# Altium schematic sheet LOGIC AND POWER.SchDoc
size A4; SheetNumber: 3; SheetTotal: 3
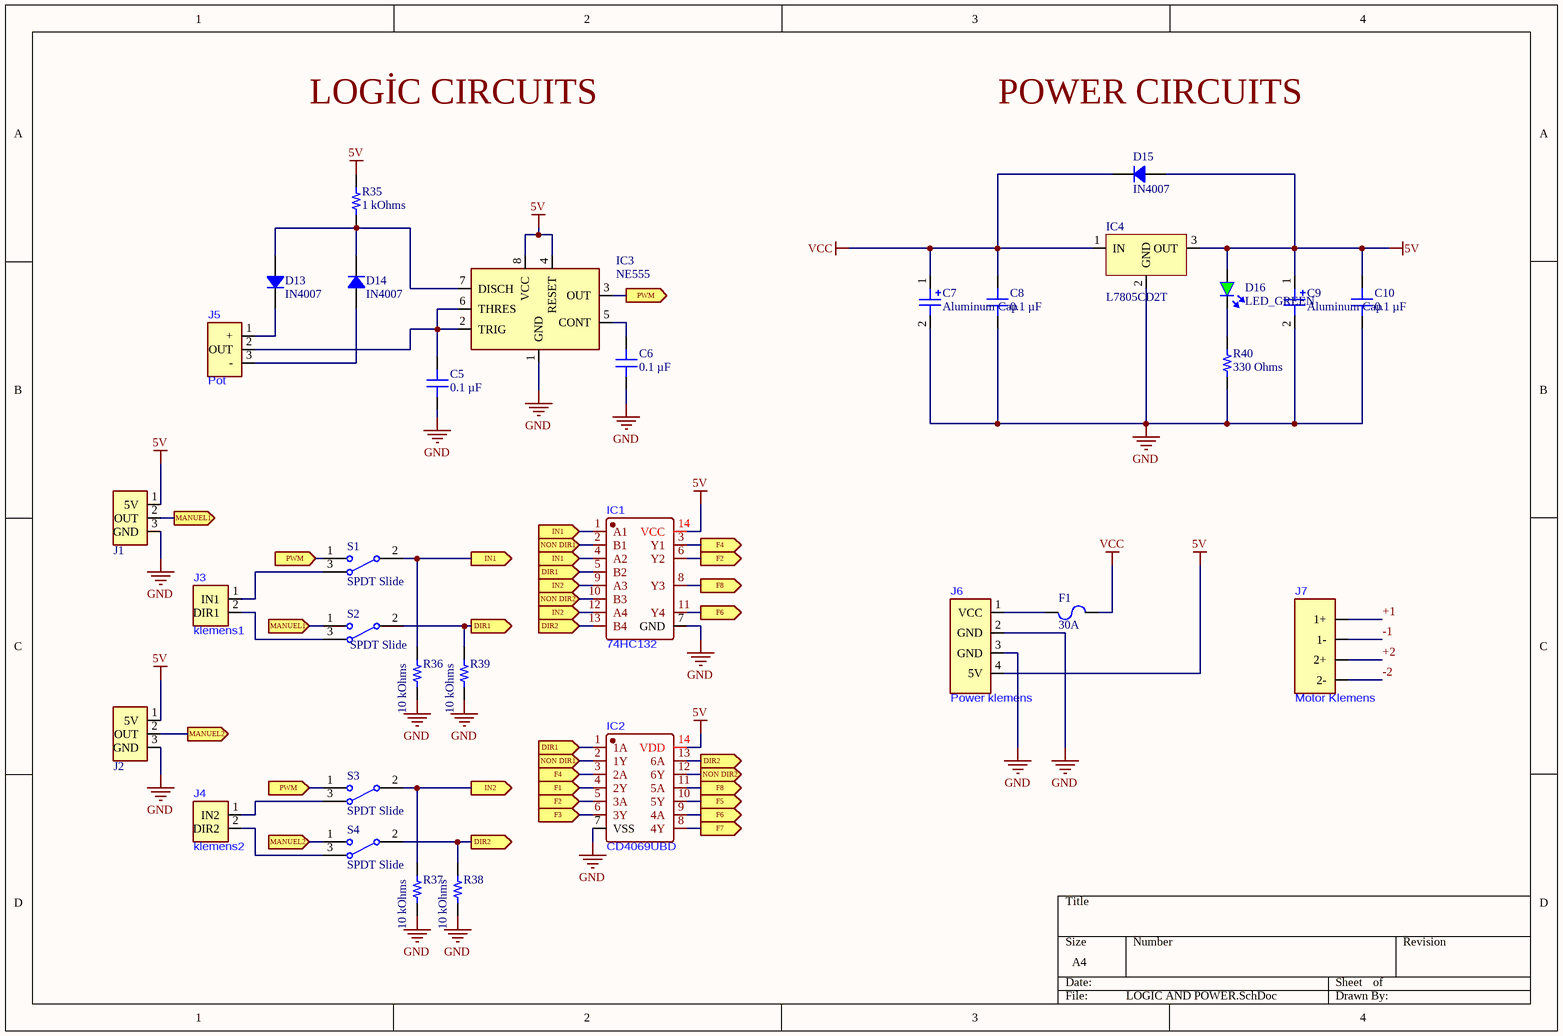
[diagram p0: LOGIC AND POWER.SchDoc]

## Parts
C5  0.1 µF  [CAP 1210_3225 - 1MM]
C6  0.1 µF  [CAP 1210_3225 - 1MM]
C7  Aluminum Cap  [Aluminum Cap]
C8  0.1 µF  [CAP 1210_3225 - 1MM]
C9  Aluminum Cap  [Aluminum Cap]
C10  0.1 µF  [CAP 1210_3225 - 1MM]
D13  IN4007  [DO214AC SMA]
D14  IN4007  [DO214AC SMA]
D15  IN4007  [DO214AC SMA]
D16  LED_GREEN  [LED_GREEN]
F1  30A  [FUSE 1206_3216 0.6MM]
IC1  74HC132  [SOIC14]
IC2  CD4069UBD  [SOIC14]
IC3  NE555  [NE5532-SOIC8]
IC4  L7805CD2T  [L7805CD2T]
J1  Switch  [JST-XH 2.54 - duplicate]  (value not drawn)
J2  Switch  [JST-XH 2.54 - duplicate]  (value not drawn)
J3  klemens1  [Klemens]
J4  klemens2  [Klemens]
J5  Pot  [JST-XH 2.54]
J6  Power klemens  [Power Klemens]
J7  Motor Klemens  [Power Klemens]
R35  1 kOhms  [RES 1206_3216]
R36  10 kOhms  [RES 1210_3225]
R37  10 kOhms  [RES 1210_3225]
R38  10 kOhms  [RES 1210_3225]
R39  10 kOhms  [RES 1210_3225]
R40  330 Ohms  [RES 1210_3225]
S1  SPDT Slide  [SPDT]
S2  SPDT Slide  [SPDT]
S3  SPDT Slide  [SPDT]
S4  SPDT Slide  [SPDT]

## Ports
DIR1 (in, see LOGIC AND POWER[2C]), DIR1 (out, see LOGIC AND POWER[2C]), DIR2 (in, see LOGIC AND POWER[2C], LOGIC AND POWER[2D]), DIR2 (out, see LOGIC AND POWER[2C]), DIR2 (out, see LOGIC AND POWER[2C], LOGIC AND POWER[2D]), F1 (in, see RIGHT_MOTOR[1B]), F2 (in, see LOGIC AND POWER[2C], RIGHT_MOTOR[1C]), F2 (out, see LOGIC AND POWER[2D], RIGHT_MOTOR[1C]), F3 (in, see RIGHT_MOTOR[4B]), F4 (in, see LOGIC AND POWER[2C], RIGHT_MOTOR[4C]), F4 (out, see LOGIC AND POWER[2D], RIGHT_MOTOR[4C]), F5 (out, see LEFT_MOTOR[1B]), F6 (out, see LEFT_MOTOR[1C], LOGIC AND POWER[2C]), F6 (out, see LEFT_MOTOR[1C], LOGIC AND POWER[2D]), F7 (out, see LEFT_MOTOR[4B]), F8 (out, see LEFT_MOTOR[4C], LOGIC AND POWER[2C]), F8 (out, see LEFT_MOTOR[4C], LOGIC AND POWER[2D]), IN1 (in, see LOGIC AND POWER[2C]), IN1 (out, see LOGIC AND POWER[2C]), IN2 (in, see LOGIC AND POWER[2C], LOGIC AND POWER[2D]), IN2 (out, see LOGIC AND POWER[2C]), MANUEL1 (in, see LOGIC AND POWER[1C]), MANUEL1 (out, see LOGIC AND POWER[1C]), MANUEL2 (in, see LOGIC AND POWER[1C]), MANUEL2 (out, see LOGIC AND POWER[1D]), NON DIR1 (in, see LOGIC AND POWER[2C]), NON DIR2 (in, see LOGIC AND POWER[2D]), NON DIR2 (out, see LOGIC AND POWER[2C]), PWM (in, see LOGIC AND POWER[1C], LOGIC AND POWER[2B]), PWM (in, see LOGIC AND POWER[1D], LOGIC AND POWER[2B]), PWM (out, see LOGIC AND POWER[1C], LOGIC AND POWER[1D])

## Nets
5V: C9.1(in) C10.2 D15.1 D16.1(IN) IC1.14(VCC) IC2.14(VDD) IC3.4(RESET) IC3.8(VCC) IC4.3(OUT) J1.1(5V) J2.1(5V) J6.4(5V) R35.1
GND: C5.1 C6.1 C7.2(out) C8.1 C9.2(out) C10.1 IC1.7(GND) IC2.7(VSS) IC3.1(GND) IC4.2(GND) J1.3(GND) J2.3(GND) J6.2(GND) J6.3(GND) R36.1 R37.1 R38.1 R39.1 R40.1
VCC: C7.1(in) C8.2 D15.2 F1.2 IC4.1(IN)
+1: J7.1(1+)
+2: J7.3(2+)
-1: J7.2(1-)
-2: J7.4(2-)
DIR1: IC1.5(B2) IC2.1(1A) R39.2 S2.2 ; port DIR1
DIR2: IC1.13(B4) IC2.13(6A) R38.2 S4.2 ; port DIR2
F1: IC2.4(2Y) ; port F1
F2: IC1.6(Y2) IC2.5(3A) ; port F2
F3: IC2.6(3Y) ; port F3
F4: IC1.3(Y1) IC2.3(2A) ; port F4
F5: IC2.10(5Y) ; port F5
F6: IC1.11(Y4) IC2.9(4A) ; port F6
F7: IC2.8(4Y) ; port F7
F8: IC1.8(Y3) IC2.11(5A) ; port F8
IN1: IC1.1(A1) IC1.4(A2) R36.2 S1.2 ; port IN1
IN2: IC1.9(A3) IC1.12(A4) R37.2 S3.2 ; port IN2
MANUEL1: J1.2(OUT) S2.1(MANUEL) ; port MANUEL1
MANUEL2: J2.2(OUT) S4.1(MANUEL) ; port MANUEL2
NON DIR1: IC1.2(B1) IC2.2(1Y) ; port NON DIR1
NON DIR2: IC1.10(B3) IC2.12(6Y) ; port NON DIR2
PWM: IC3.3(OUT) S1.1(PWM) S3.1(PWM) ; port PWM
NetC5_2: C5.2 IC3.2(TRIG) IC3.6(THRES) J5.2(OUT)
NetC6_2: C6.2 IC3.5(CONT)
NetD13_1: D13.1 D14.2 IC3.7(DISCH) R35.2
NetD13_2: D13.2 J5.1(+)
NetD14_1: D14.1 J5.3(-)
NetD16_2: D16.2(OUT) R40.2
NetF1_1: F1.1 J6.1(VCC)
NetJ3_1: J3.1(IN1) S1.3(MCU)
NetJ3_2: J3.2(DIR1) S2.3(MCU)
NetJ4_1: J4.1(IN2) S3.3(MCU)
NetJ4_2: J4.2(DIR2) S4.3(MCU)

## Notes on the sheet
- Labels drawn without touching a wire or pin: LOGİC CIRCUITS, POWER CIRCUITS

## Library data of the parts
C5 C6 C8 C10 = 1210Y0500104KST: 1210 50VDC 100NF 10% X7R(2R1) AE; manufacturer: Knowles Syfer; Voltage - Rated: 50V; Part Number: 1210Y0500104KST; Value: 0.1 µF; Applications: Automotive, Boardflex Sensitive; Capacitance: 0.1 µF; componentlink2description: DigiKey Link; componentlink2url: https://www.digikey.com/en/products/detail/knowles-syfer/1210Y0500104KST/18879780; Device Package: 1210 (3225 Metric); Features: Soft Termination; Lifecycle Status: Active; Minimum Order: 1; Mounting Type: Surface Mount, MLCC; Operating Temperature: -55°C ~ 125°C; Package / Case: 1210 (3225 Metric); packaging: TapeAndReel; partid: 53037; Part Status: Active; price: 0.16; Ratings: AEC-Q200; series: FlexiCap™; Size / Dimension: 0.126" L x 0.098" W (3.20mm x 2.50mm); Supplier 1: DigiKey; Supplier Part Number 1: 1608-1210Y0500104KSTCT-ND; Temperature Coefficient: X7R (2R1); Thickness (Max): 0.079" (2.00mm); Tolerance: ±10%
  C5 C6: lastupdated: 18.12.2023 20:42:16
  C8 C10: lastupdated: 5.12.2023 20:39:07
D13-D15 = RS1A: DIODE GEN PURP 50V 1A SMA; Part Number: RS1A; Manufacturer: ON Semiconductor; Capacitance @ Vr, F: 10pF @ 4V, 1MHz; Current - Reverse Leakage @ Vr: 5µA @ 50V; Diode Type: Standard; Reverse Recovery Time (trr): 150ns; Speed: Fast Recovery =< 500ns, > 200mA (Io); Voltage - Forward (Vf) (Max) @ If: 1.3V @ 1A; ComponentLink1Description: Datasheet; ComponentLink1URL: https://www.onsemi.com/pub/Collateral/RS1M-D.PDF; ComponentLink2Description: DigiKey Link; ComponentLink2URL: http://digikey.com/product-detail/en/on-semiconductor/RS1A/RS1ACT-ND/3504478; Current - Average Rectified (Io): 1A; LastUpdated: 4.12.2023 21:20:44; Lifecycle Status: Active; Minimum Order: 1; Mounting Type: Surface Mount; Operating Temperature - Junction: -55°C ~ 150°C; Package / Case: DO-214AC, SMA; Packaging: TapeAndReel; PartId: 585; Part Status: Active; Price: 0.08; Series: -; Supplier 1: DigiKey; Supplier Part Number 1: RS1ACT-ND; Supplier Device Package: SMA (DO-214AC); Voltage - DC Reverse (Vr) (Max): 50V
F1 = 3413.0120.22: FUSE BOARD MNT 2.5A 32VAC 63VDC; Manufacturer: Schurter Inc.; Approval Agency: cURus; Breaking Capacity @ Rated Voltage: 50A; Fuse Type: Board Mount (Cartridge Style Excluded); Melting I²t: 0.35; Response Time: Fast Blow; Voltage Rating - AC: 32V; Voltage Rating - DC: 63V; Part Number: 3413.0120.22; Approvals: cURus; ComponentLink1Description: Datasheet; ComponentLink1URL: http://www.schurterinc.com/bundles/snceschurter/epim/_ProdPool_/newDS/en/typ_USF_1206.pdf; ComponentLink2Description: DigiKey Link; ComponentLink2URL: http://digikey.com/product-detail/en/schurter-inc/3413.0120.22/486-1681-1-ND/2870086; Current Rating (Amps): 2.5A; Device Package: 1206 (3216 Metric); LastUpdated: 2.09.2020 01:30:41; Lifecycle Status: Active; Minimum Order: 1; Mounting Type: Surface Mount; Operating Temperature: -55°C ~ 90°C; Package / Case: 1206 (3216 Metric); Packaging: TapeAndReel; Part Status: Active; Price: 0.24; Series: USF 1206; Size / Dimension: 0.126" L x 0.063" W x 0.024" H (3.20mm x 1.60mm x 0.60mm); Supplier 1: DigiKey; Supplier Part Number 1: 486-1681-1-ND
R35 = RNCS1206BKE1K00: RES 1K OHM 0.1% 1/8W 1206; Manufacturer: Stackpole Electronics Inc; Power (Watts): 0.125W, 1/8W; Temperature Coefficient: ±25ppm/°C; Part Number: RNCS1206BKE1K00; ComponentLink1Description: Datasheet; ComponentLink1URL: https://www.seielect.com/catalog/sei-rncs_rnch.pdf; ComponentLink2Description: DigiKey Link; ComponentLink2URL: https://www.digikey.com/en/products/detail/stackpole-electronics-inc/RNCS1206BKE1K00/1800333; Composition: Thin Film; Device Package: 1206 (3216 Metric); Features: Anti-Corrosive, Automotive AEC-Q200, Moisture Resistant; Height - Seated (Max): 0.026" (0.65mm); LastUpdated: 8.12.2023 20:55:21; Lifecycle Status: Active; Minimum Order: 1; Number of Terminations: 2; Operating Temperature: -55°C ~ 155°C; Package / Case: 1206 (3216 Metric); Packaging: TapeAndReel; PartId: 26856; Part Status: Active; Price: 0.08; Ratings: AEC-Q200; Resistance: 1 kOhms; Series: RNCS; Size / Dimension: 0.120" L x 0.061" W (3.05mm x 1.55mm); Supplier 1: DigiKey; Supplier Part Number 1: RNCS1206BKE1K00CT-ND; Supplier Device Package: 1206; Tolerance: ±0.1%; Value: 1 kOhms
R36-R39 = RMCF1210FT10K0: RES 10K OHM 1% 1/2W 1210; Manufacturer: Stackpole Electronics Inc; Power (Watts): 0.5W, 1/2W; Temperature Coefficient: ±100ppm/°C; Part Number: RMCF1210FT10K0; ComponentLink1Description: Datasheet; ComponentLink1URL: https://www.seielect.com/catalog/sei-rmcf_rmcp.pdf; ComponentLink2Description: DigiKey Link; ComponentLink2URL: https://www.digikey.com/en/products/detail/stackpole-electronics-inc/RMCF1210FT10K0/1758528; Composition: Thick Film; Device Package: 1210 (3225 Metric); Features: Automotive AEC-Q200; Height - Seated (Max): 0.028" (0.70mm); LastUpdated: 17.12.2023 21:51:18; Lifecycle Status: Active; Minimum Order: 1; Number of Terminations: 2; Operating Temperature: -55°C ~ 155°C; Package / Case: 1210 (3225 Metric); Packaging: TapeAndReel; Part Status: Active; Price: 0.01; Ratings: AEC-Q200; Resistance: 10 kOhms; Series: RMCF; Size / Dimension: 0.126" L x 0.098" W (3.20mm x 2.50mm); Supplier 1: DigiKey; Supplier Part Number 1: RMCF1210FT10K0CT-ND; Supplier Device Package: 1210; Tolerance: ±1%; Value: 10 kOhms
R40 = RMCF1210FT330R: RES 330 OHM 1% 1/2W 1210; Manufacturer: Stackpole Electronics Inc; Power (Watts): 0.5W, 1/2W; Temperature Coefficient: ±100ppm/°C; Part Number: RMCF1210FT330R; ComponentLink1Description: Datasheet; ComponentLink1URL: https://www.seielect.com/catalog/sei-rmcf_rmcp.pdf; ComponentLink2Description: DigiKey Link; ComponentLink2URL: https://www.digikey.com/en/products/detail/stackpole-electronics-inc/RMCF1210FT330R/1715564; Composition: Thick Film; Device Package: 1210 (3225 Metric); Features: Automotive AEC-Q200; Height - Seated (Max): 0.028" (0.70mm); LastUpdated: 17.12.2023 21:51:11; Lifecycle Status: Active; Minimum Order: 1; Number of Terminations: 2; Operating Temperature: -55°C ~ 155°C; Package / Case: 1210 (3225 Metric); Packaging: TapeAndReel; Part Status: Active; Price: 0.01; Ratings: AEC-Q200; Resistance: 330 Ohms; Series: RMCF; Size / Dimension: 0.126" L x 0.098" W (3.20mm x 2.50mm); Supplier 1: DigiKey; Supplier Part Number 1: RMCF1210FT330RCT-ND; Supplier Device Package: 1210; Tolerance: ±1%; Value: 330 Ohms